# EAGLE design seismometer_potboard (EAGLE 7.0.0)
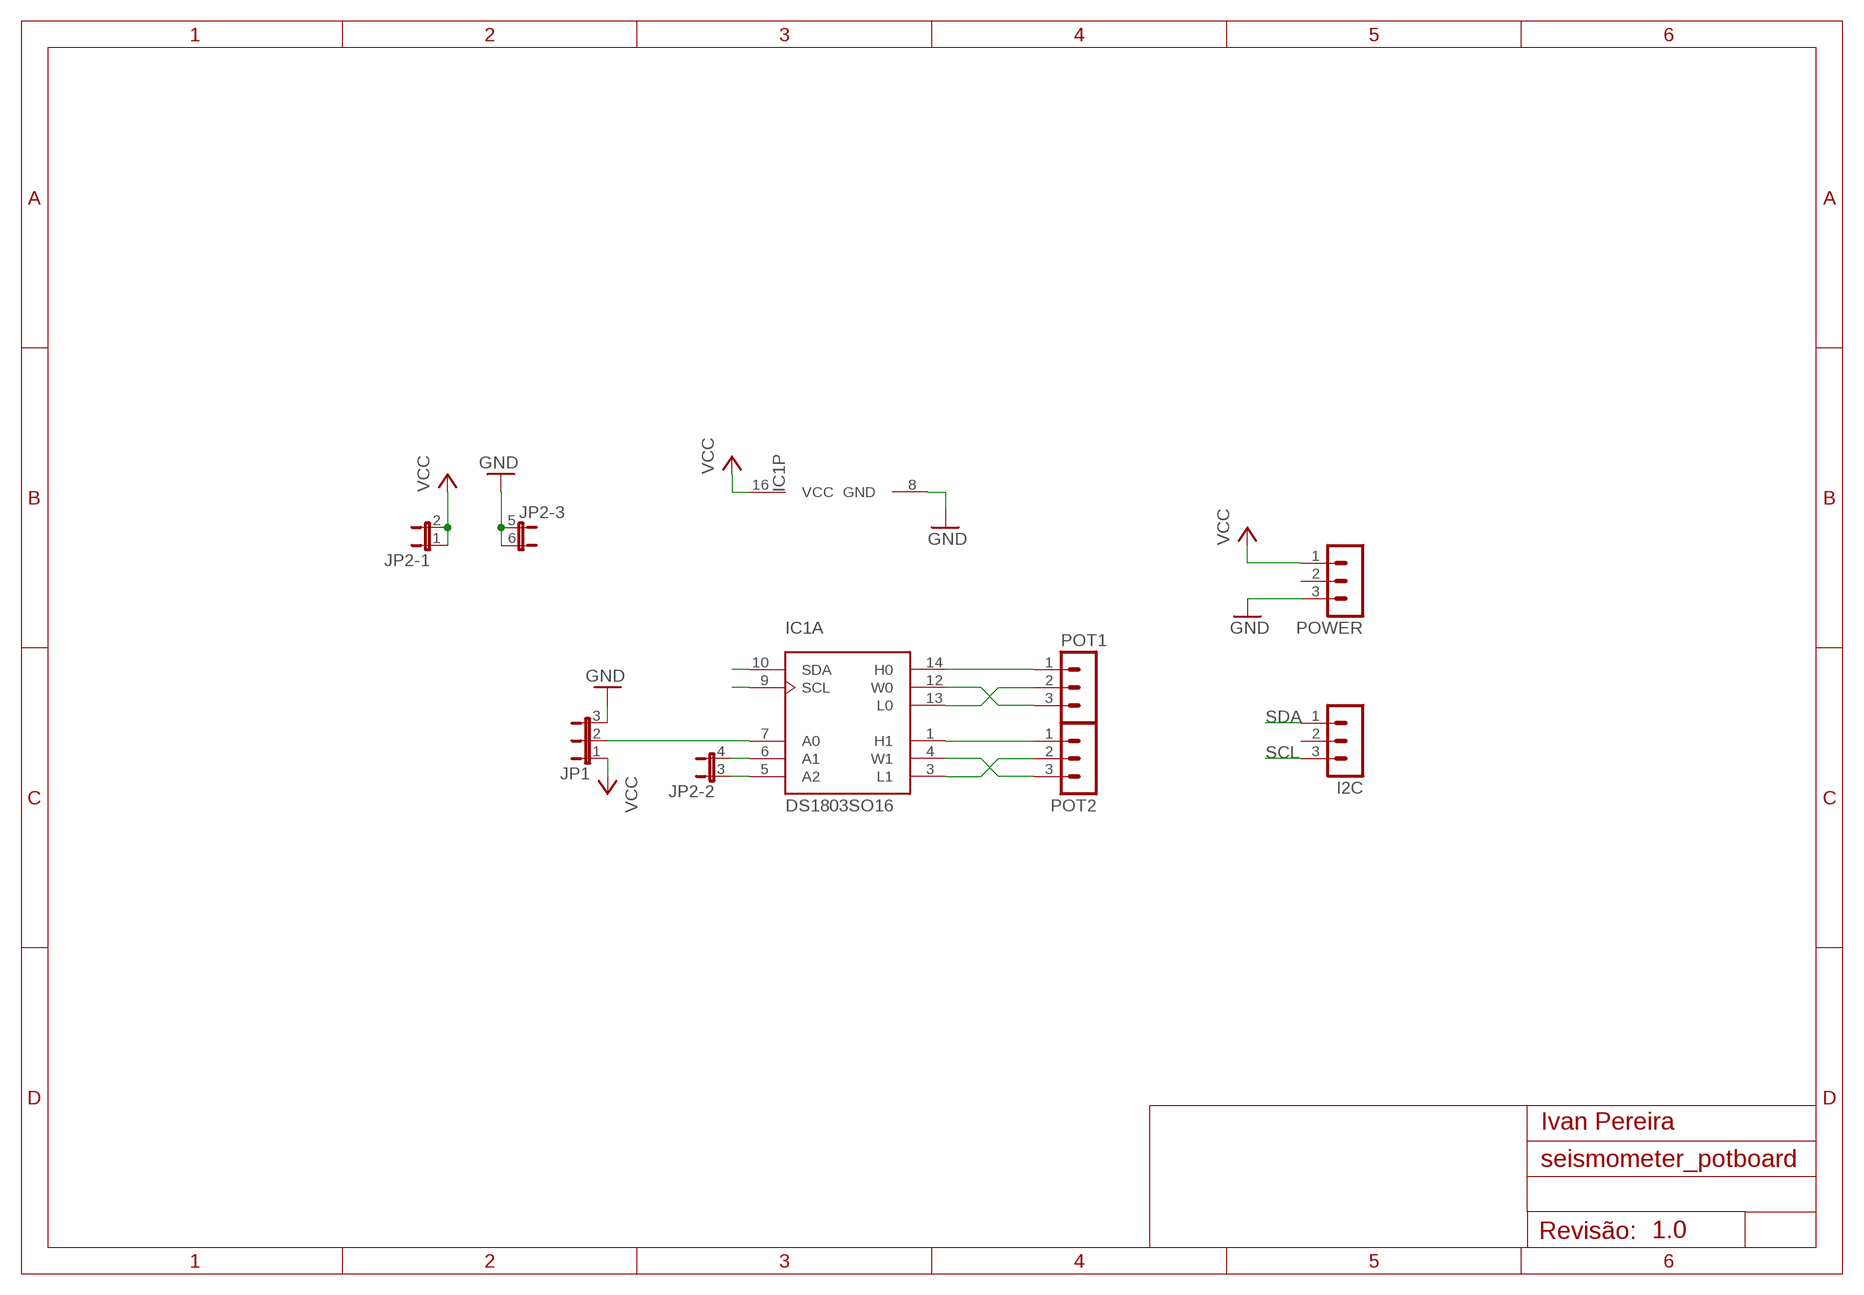
[diagram p0: schematic, sheet 1]
FRAME1 (A4L-LOC): AUTHOR: Ivan Pereira; REV: 1.0

## Parts
I2C  MA03-1  [MA03-1]
IC1  DS1803SO16  [SO16]
JP1  JP2E  [JP2]
JP2  JP3QE  [JP3Q]
POT1  MA03-1  [MA03-1]
POT2  MA03-1  [MA03-1]
POWER  MA03-1  [MA03-1]

## Nets
GND: IC1.8(P:GND) JP1.3 JP2.5 JP2.6 POWER.3
N$1: IC1.5(A:A2) JP2.3
N$2: IC1.6(A:A1) JP2.4
N$3: IC1.7(A:A0) JP1.2
N$4: IC1.14(A:H0) POT1.1
N$5: IC1.13(A:L0) POT1.2
N$6: IC1.12(A:W0) POT1.3
N$7: IC1.1(A:H1) POT2.1
N$8: IC1.3(A:L1) POT2.2
N$9: IC1.4(A:W1) POT2.3
SCL: I2C.3 IC1.9(A:SCL)
SDA: I2C.1 IC1.10(A:SDA)
VCC: IC1.16(P:VCC) JP1.1 JP2.1 JP2.2 POWER.1
Unconnected: I2C.2 POWER.2

## Library data of the parts
I2C POT1 POT2 POWER = con-lstb:MA03-1: PIN HEADER; OC_FARNELL: unknown; OC_NEWARK: unknown
IC1 = ds1803:DS1803?: Addresable Dual Digital Potentiometer
JP1 = jumper:JP2E: JUMPER
JP2 = jumper:JP3QE: JUMPER

## Board
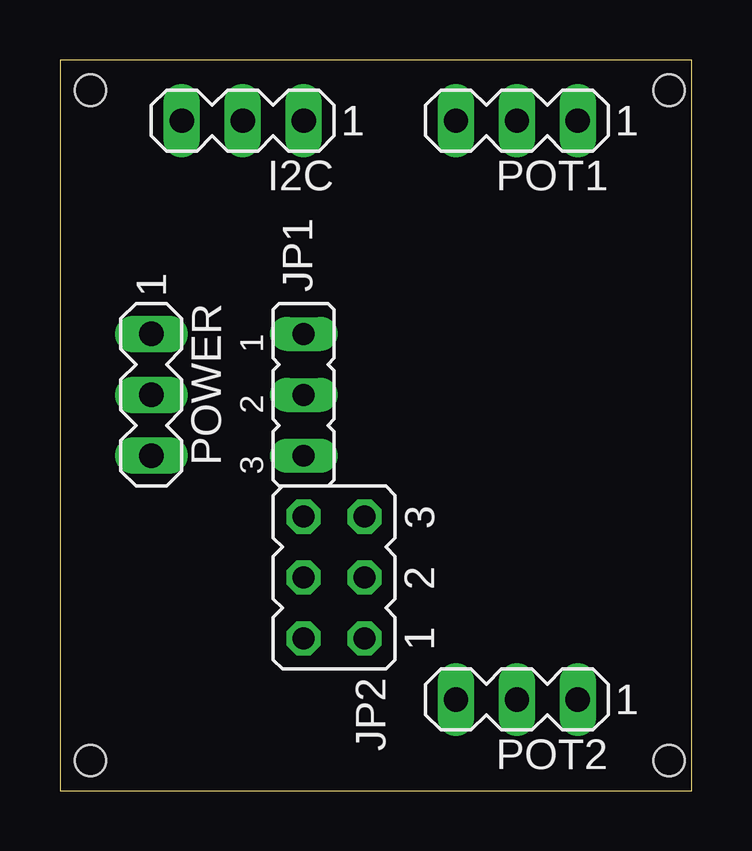
[diagram p1: board, top side]
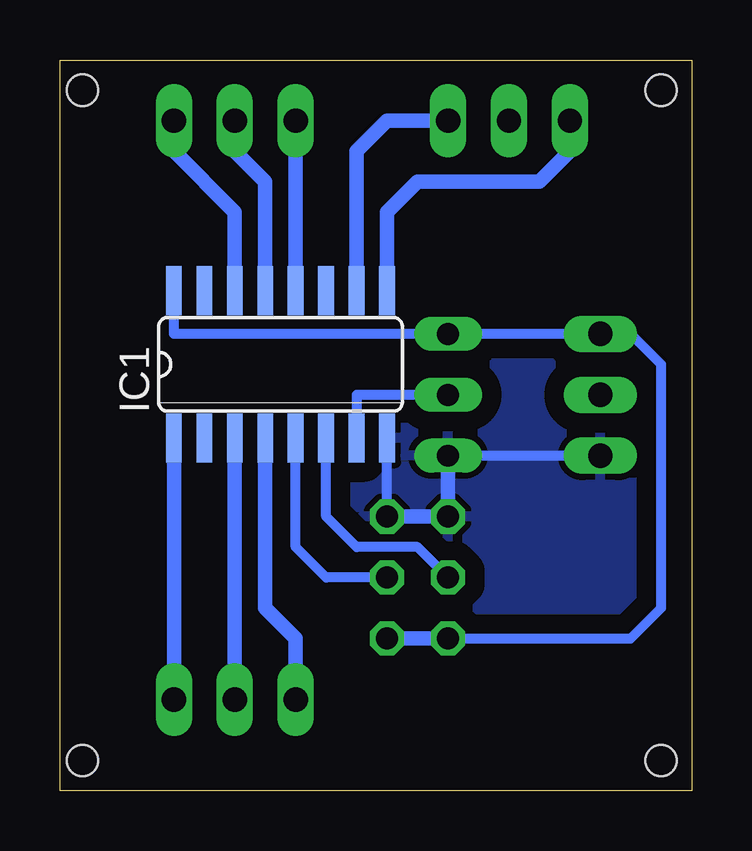
[diagram p2: board, bottom side, seen from below]

Size 26.34 x 30.47 mm. Coordinates in mm from the lower left corner, seen from the top.
Outline: 0,0 26.34,0 26.34,30.47 0,30.47 0,0
Copper layers (1*16): Top 0.035mm / dielectric 1.5mm / Bottom 0.035mm
Design rules "default": minimum track width 10mil, minimum drill 24mil, track to track 8mil, track to pad 8mil, pad to pad 8mil, via to via 8mil, smd to smd 8mil, copper to edge 40mil, drill to drill 8mil, minimum pad ring 10mil, minimum via ring 8mil, stop-mask expansion 4mil, vias tented up to drill 0mil, thermal gap 10mil
Holes 1.3 mm at 1.27,29.21 1.27,1.27 25.4,1.27 25.4,29.21

### Footprints (pad centres in the part's own frame; a part is rotated, then mirrored left to right if it is on the bottom)
MA03-1 = drill 1.016 long: 1 -2.54,0; 2 0,0; 3 2.54,0
SO16 = smd 0.66 x 2.032: 1 -4.445,-3.073; 2 -3.175,-3.073; 3 -1.905,-3.073; 4 -0.635,-3.073; 5 0.635,-3.073; 6 1.905,-3.073; 7 3.175,-3.073; 8 4.445,-3.073; 9 4.445,3.073; 10 3.175,3.073; 11 1.905,3.073; 12 0.635,3.073; 13 -0.635,3.073; 14 -1.905,3.073; 15 -3.175,3.073; 16 -4.445,3.073
JP2 = drill 0.914 long: 1 -2.54,0; 2 0,0; 3 2.54,0
JP3Q = drill 0.914 octagon: 1 -2.54,-1.27; 2 -2.54,1.27; 3 0,-1.27; 4 0,1.27; 5 2.54,-1.27; 6 2.54,1.27

### Placement (x,y rotation side)
I2C  7.62,27.94 180 top
IC1  17.14,17.78 0 bottom
JP1  10.16,16.51 270 top
JP2  11.43,8.89 90 top
POT1  19.05,27.94 180 top
POT2  19.05,3.81 180 top
POWER  3.81,16.51 270 top

### Tracks (layer width: path | path; a pad name or v marks a point on that pad's centre or on a via)
GND
  Bottom 0.406: JP2.5 IC1.8 | POWER.3 JP1.3
  Bottom 0.61: JP1.3 JP2.6 JP2.5
  pour Bottom (isolate 0.813): 1.27,1.27 25.4,1.27 25.4,31.75 1.27,31.75
N$1
  Bottom 0.406: JP2.3 15.24,8.89 16.51,10.16 IC1.5
N$2
  Bottom 0.406: JP2.4 11.43,10.16 13.97,10.16 15.24,11.43 IC1.6
N$3
  Bottom 0.406: JP1.2 13.97,16.51 IC1.7
N$4
  Bottom 0.61: IC1.14 19.05,24.13 21.59,26.67 POT1.1
N$5
  Bottom 0.61: IC1.13 17.78,25.4 19.05,26.67 POT1.2
N$6
  Bottom 0.61: IC1.12 POT1.3
N$7
  Bottom 0.61: IC1.1 POT2.1
N$8
  Bottom 0.61: IC1.3 POT2.2
N$9
  Bottom 0.61: IC1.4 17.78,7.62 16.51,6.35 POT2.3
SCL
  Bottom 0.61: IC1.9 12.7,24.13 11.43,25.4 6.35,25.4 5.08,26.67 I2C.3
SDA
  Bottom 0.61: IC1.10 13.97,26.67 12.7,27.94 I2C.1
VCC
  Bottom 0.406: JP2.2 2.54,6.35 1.27,7.62 1.27,17.78 2.54,19.05 POWER.1 JP1.1 21.59,19.05 IC1.16
  Bottom 0.61: JP2.2 JP2.1